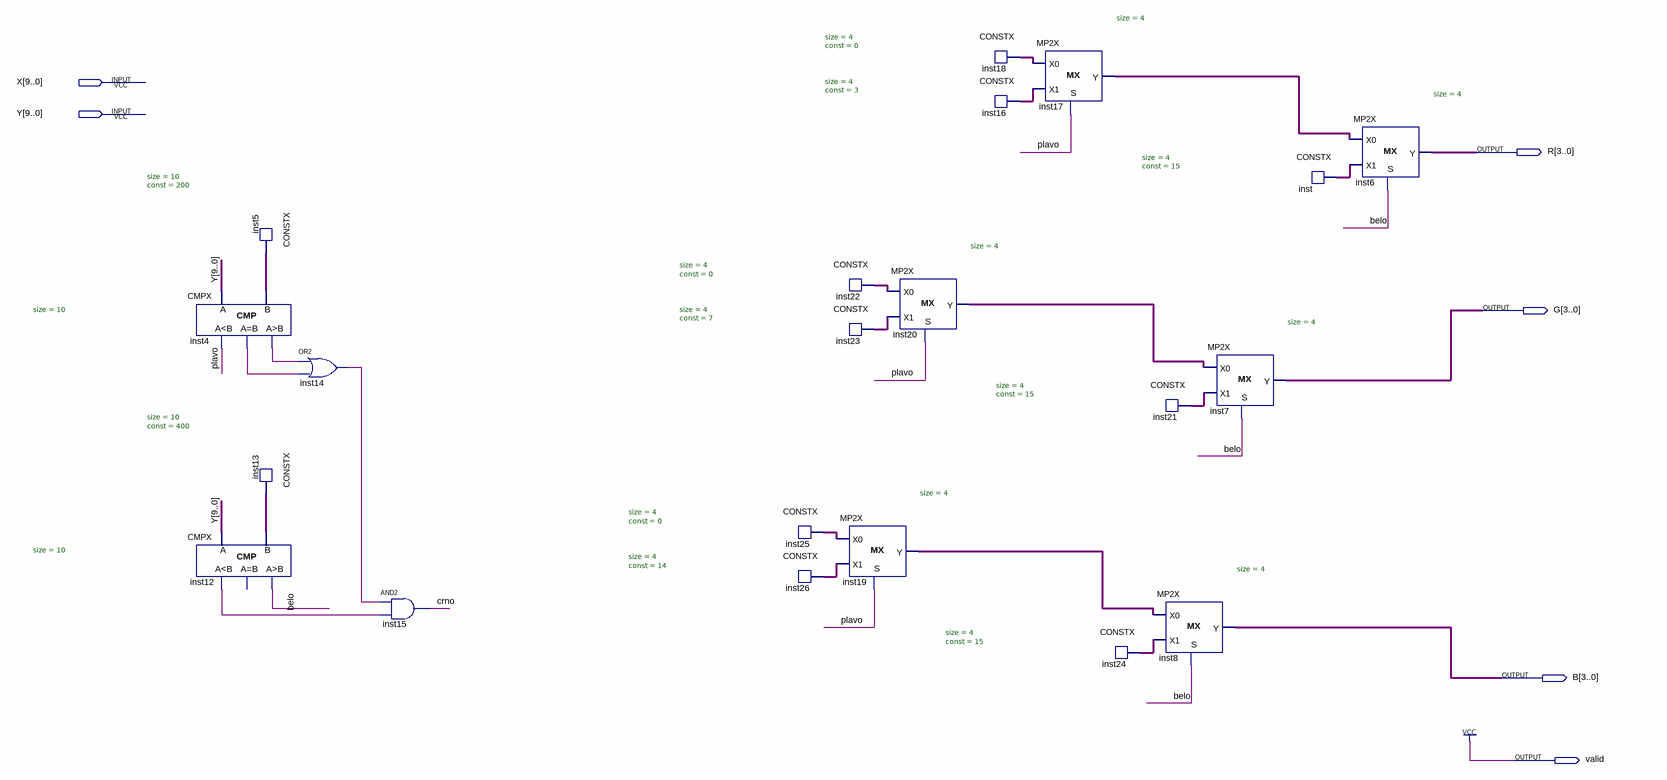
[diagram p0: schematic sheet]
// Quartus schematic Estonija.bdf as structural Verilog: 21 symbols, 6 pins
module Estonija (
  input  [9:0] X,
  input  [9:0] Y,
  output [3:0] R,
  output [3:0] G,
  output [3:0] B,
  output valid
);

  wire belo, crno, inst4_eq, inst4_gr, inst12_ls, inst14_out, plavo;
  wire [3:0] inst16_data, inst17_y, inst18_data, inst19_y, inst20_y, inst21_data, inst22_data, inst23_data,
       inst24_data, inst25_data, inst26_data, inst_data;
  wire [9:0] inst5_data, inst13_data;

  CMPX #(.size(10)) inst4 (.A(Y), .B(inst5_data), .ls(plavo), .eq(inst4_eq), .gr(inst4_gr));
  CMPX #(.size(10)) inst12 (.A(Y), .B(inst13_data), .ls(inst12_ls), .gr(belo));  // open: eq
  CONSTX #(.size(10), .\const (200)) inst5 (.data(inst5_data));
  CONSTX #(.size(10), .\const (400)) inst13 (.data(inst13_data));
  or inst14 (inst14_out, inst4_gr, inst4_eq);
  and inst15 (crno, inst14_out, inst12_ls);
  CONSTX #(.size(4), .\const (0)) inst25 (.data(inst25_data));
  CONSTX #(.size(4), .\const (14)) inst26 (.data(inst26_data));
  CONSTX #(.size(4), .\const (0)) inst22 (.data(inst22_data));
  CONSTX #(.size(4), .\const (7)) inst23 (.data(inst23_data));
  MP2X #(.size(4)) inst19 (.S(plavo), .X0(inst25_data), .X1(inst26_data), .Y(inst19_y));
  MP2X #(.size(4)) inst20 (.S(plavo), .X0(inst22_data), .X1(inst23_data), .Y(inst20_y));
  CONSTX #(.size(4), .\const (0)) inst18 (.data(inst18_data));
  CONSTX #(.size(4), .\const (3)) inst16 (.data(inst16_data));
  MP2X #(.size(4)) inst17 (.S(plavo), .X0(inst18_data), .X1(inst16_data), .Y(inst17_y));
  CONSTX #(.size(4), .\const (15)) inst24 (.data(inst24_data));
  CONSTX #(.size(4), .\const (15)) inst21 (.data(inst21_data));
  MP2X #(.size(4)) inst8 (.S(belo), .X0(inst19_y), .X1(inst24_data), .Y(B));
  MP2X #(.size(4)) inst7 (.S(belo), .X0(inst20_y), .X1(inst21_data), .Y(G));
  CONSTX #(.size(4), .\const (15)) inst (.data(inst_data));
  MP2X #(.size(4)) inst6 (.S(belo), .X0(inst17_y), .X1(inst_data), .Y(R));

  assign valid = 1'b1;
endmodule
